# EAGLE design NE555 GEN_switchLEDv1 (EAGLE 9.0.1)
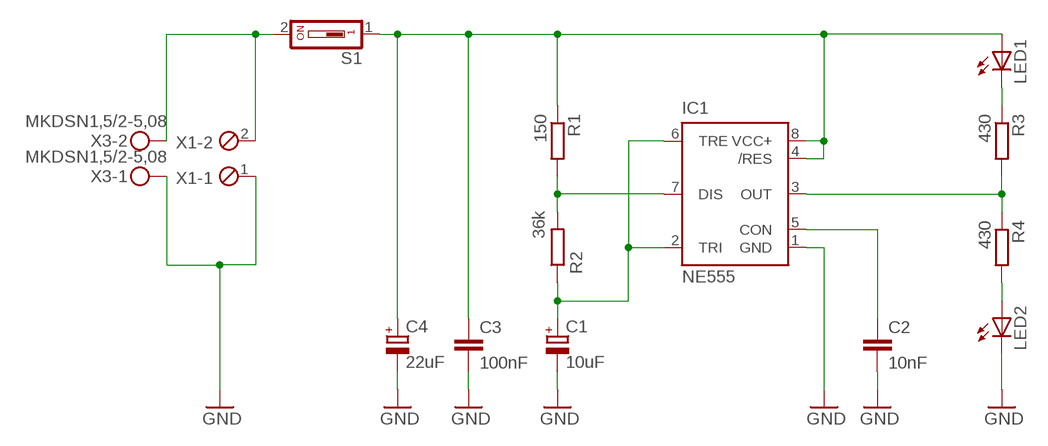
[diagram p0: schematic, sheet 1]

## Parts
C1  10uF  CPOL-EUE2.5-5  [E2,5-5]
C2  10nF  C-EU050-024X044  [C050-024X044]
C3  100nF  C-EU025-024X044  [C025-024X044]
C4  22uF  CPOL-EUE2.5-7  [E2,5-7]
IC1  NE555  [DIL-08]
LED1  LED5MM  [LED5MM]
LED2  LED5MM  [LED5MM]
R1  150  R-EU_0207/7  [0207/7]
R2  36k  R-EU_0207/7  [0207/7]
R3  430  R-EU_0207/7  [0207/7]
R4  430  R-EU_0207/7  [0207/7]
S1  DS01  [DS-01]
X1  MPT2  [2POL254]
X3  MKDSN1,5/2-5,08  [MKDSN1,5/2-5,08]

## Nets
GND: C1.- C2.2 C3.2 C4.- IC1.1(GND) LED2.K(C) X1.1 X3.1
N$1: C3.1 C4.+ IC1.4(/RES) IC1.8(VCC+) LED1.A R1.1 S1.1
N$2: C1.+ IC1.2(TRI) IC1.6(TRE) R2.1
N$3: IC1.7(DIS) R1.2 R2.2
N$4: S1.2 X1.2 X3.2
N$7: C2.1 IC1.5(CON)
N$8: LED1.K(C) R3.1
N$9: IC1.3(OUT) R3.2 R4.1
N$10: LED2.A R4.2

## Library data of the parts
C1 C4 = rcl:CPOL-EU: POLARIZED CAPACITOR, European symbol
C2 C3 = rcl:C-EU: CAPACITOR, European symbol
IC1 = st-microelectronics:NE555: General purpose bipolar Timer; MF: Arrow Electronics; MPN: NE555N; OC_FARNELL: 1467742; OC_NEWARK: 89K1486
LED1 LED2 = led:LED: LED OSRAM: - CHIPLED LG R971, LG N971, LY N971, LG Q971, LY Q971, LO R971, LY R971 LH N974, LH R974 LS Q976, LO Q976, LY Q976 LO Q996 - Hyper CHIPLED LW Q18S LB Q993, LB Q99A, LB R99A - SideLED LS A670, LO A670, LY A670, LG A670, LP A670 LB A673, LV A673, LT A673, LW A673 LH A674 LY A675 LS A676, LA A676, LO A676, LY A676, LW A676 LS A679, LY A679, LG A679 - Hyper Micro SIDELED® LS Y876, LA Y876, LO Y876, LY Y876 LT Y87S - SmartLED LW L88C, LW L88S LB L89C, LB L89S, LG L890 LS L89K, LO L89K, LY L89K LS L896, LA L896, LO L896, LY L896 - TOPLED LS T670, LO T670, LY T670, LG T670, LP T670 LSG T670, LSP T670, LSY T670, LOP T670, LYG T670 LG T671, LOG T671, LSG T671 LB T673, LV T673, LT T673, LW T673 LH T674 LS T676, LA T676, LO T676, LY T676, LB T676, LH T676, LSB T676, LW T676 LB T67C, LV T67C, LT T67C, LS T67K, LO T67K, LY T67K, LW E67C LS E67B, LA E67B, LO E67B, LY E67B, LB E67C, LV E67C, LT E67C LW T67C LS T679, LY T679, LG T679 LS T770, LO T770, LY T770, LG T770, LP T770 LB T773, LV T773, LT T773, LW T773 LH T774 LS E675, LA E675, LY E675, LS T675 LS T776, LA T776, LO T776, LY T776, LB T776 LHGB T686 LT T68C, LB T68C - Hyper Mini TOPLED® LB M676 - Mini TOPLED Santana® LG M470 LS M47K, LO M47K, LY M47K Source: http://www.osram.convergy.de LUXEON: - LUMILED® LXK2-PW12-R00, LXK2-PW12-S00, LXK2-PW14-U00, LXK2-PW14-V00 LXK2-PM12-R00, LXK2-PM12-S00, LXK2-PM14-U00 LXK2-PE12-Q00, LXK2-PE12-R00, LXK2-PE12-S00, LXK2-PE14-T00, LXK2-PE14-U00 LXK2-PB12-K00, LXK2-PB12-L00, LXK2-PB12-M00, LXK2-PB14-N00, LXK2-PB14-P00, LXK2-PB14-Q00 LXK2-PR12-L00, LXK2-PR12-M00, LXK2-PR14-Q00, LXK2-PR14-R00 LXK2-PD12-Q00, LXK2-PD12-R00, LXK2-PD12-S00 LXK2-PH12-R00, LXK2-PH12-S00 LXK2-PL12-P00, LXK2-PL12-Q00, LXK2-PL12-R00 Source: www.luxeon.com KINGBRIGHT: KA-3528ASYC Source: www.kingbright.com
R1-R4 = rcl:R-EU_: RESISTOR, European symbol
S1 = switch-dil:DS01: DIL/CODE SWITCH; OC_FARNELL: unknown; OC_NEWARK: unknown
X1 = con-phoenix-254:MPT2: PHOENIX CONNECTOR; OC_FARNELL: unknown; OC_NEWARK: unknown
X3 = con-phoenix-508:MKDSN1,5/2-5,08: MKDSN 1,5/ 2-5,08 Printklemme Nennstrom: 13,5 A Nennspannung: 250 V Rastermaß: 5,08 mm Polzahl: 2 Anschlussart: Schraubanschluss Montage: Löten Anschlussrichtung Leiter/Platine: 0 ° Artikelnummer: 1729128 Source: http://eshop.phoenixcontact.com .. 1729128.pdf

## Board
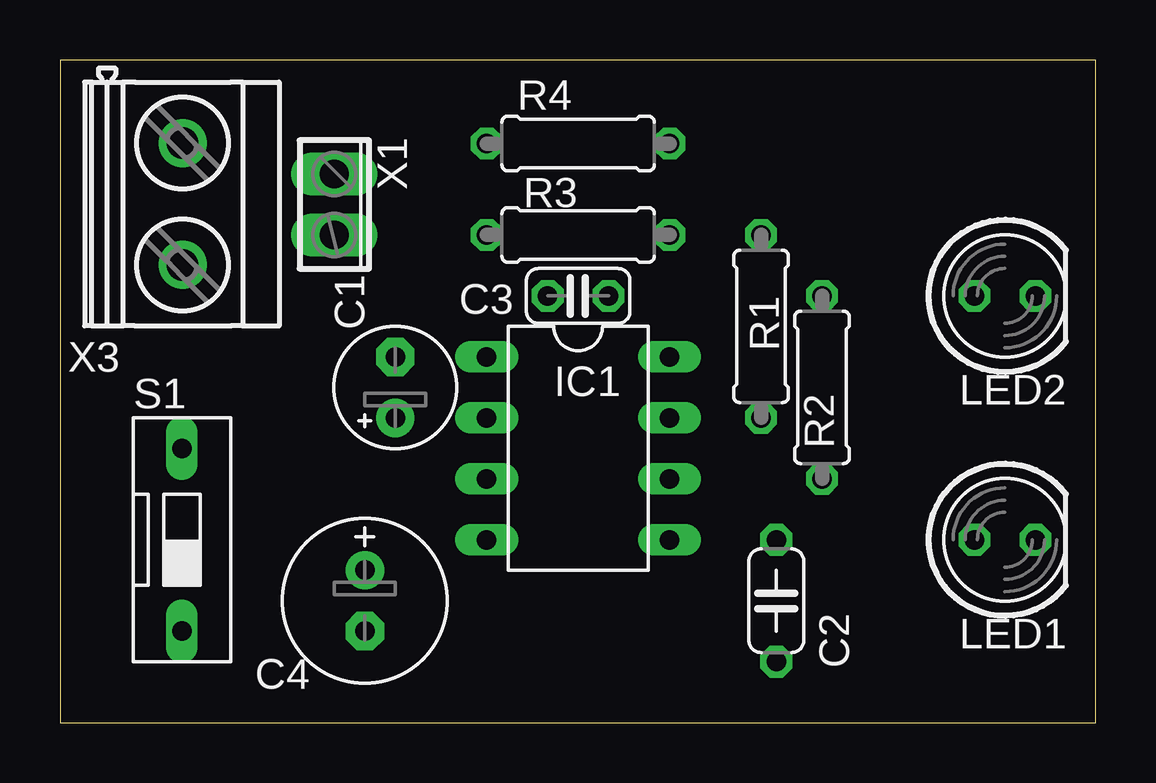
[diagram p1: board, top side]
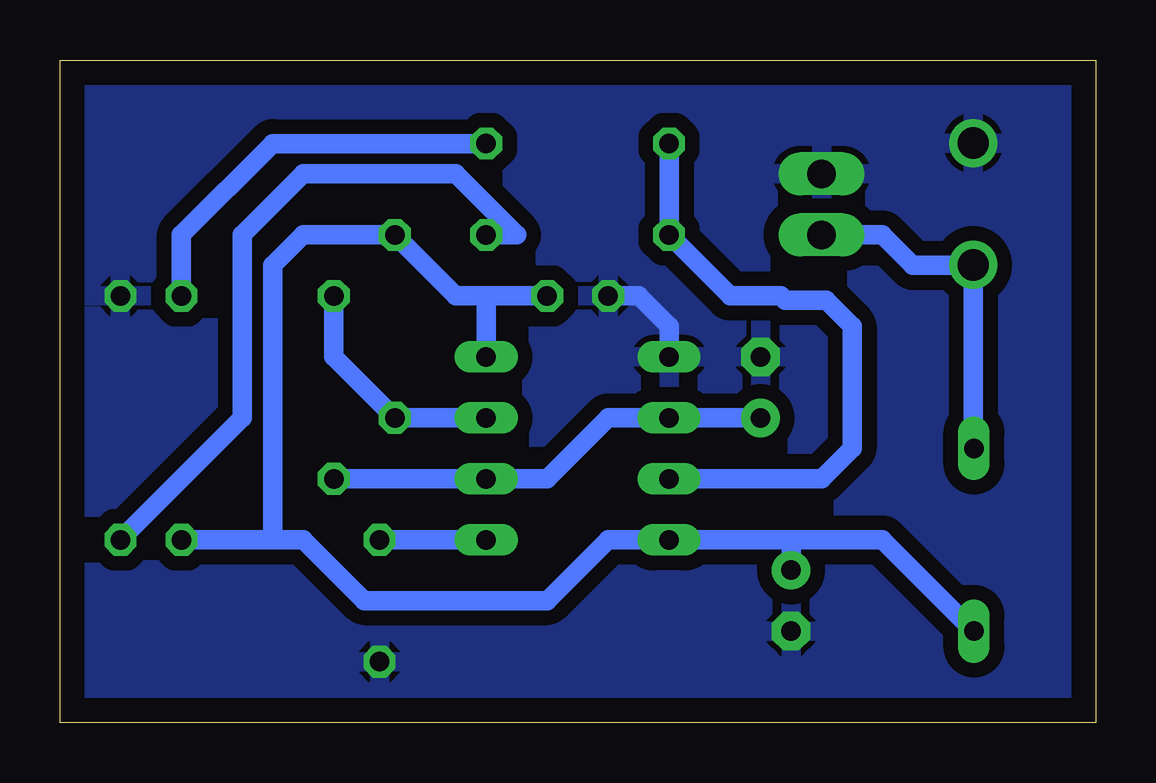
[diagram p2: board, bottom side, seen from below]

Size 43.16 x 27.61 mm. Coordinates in mm from the lower left corner, seen from the top.
Outline: 0,0 43.16,0 43.16,27.61 0,27.61 0,0
Copper layers (1*16): Top 0.035mm / dielectric 1.5mm / Bottom 0.035mm
Design rules "default": minimum track width 6mil, minimum drill 0.35mm, track to track 6mil, track to pad 6mil, pad to pad 6mil, via to via 6mil, smd to smd 6mil, copper to edge 40mil, drill to drill 6mil, minimum pad ring 10mil, minimum via ring 8mil, stop-mask expansion 4mil, vias tented up to drill 0mil, thermal gap 10mil

### Footprints (pad centres in the part's own frame; a part is rotated, then mirrored left to right if it is on the bottom)
E2,5-5 = drill 0.813 pad 1.6: + -1.27,0 | drill 0.813 pad 1.6 octagon: - 1.27,0
C050-024X044 = drill 0.813 octagon: 1 -2.54,0; 2 2.54,0
C025-024X044 = drill 0.813 octagon: 1 -1.27,0; 2 1.27,0
E2,5-7 = drill 0.813 pad 1.6: + -1.27,0 | drill 0.813 pad 1.6 octagon: - 1.27,0
DIL-08 = drill 0.813 long: 1 -3.81,-3.81; 2 -1.27,-3.81; 3 1.27,-3.81; 4 3.81,-3.81; 5 3.81,3.81; 6 1.27,3.81; 7 -1.27,3.81; 8 -3.81,3.81
LED5MM = drill 0.813 octagon: A -1.27,0; K 1.27,0
0207/7 = drill 0.813 octagon: 1 -3.81,0; 2 3.81,0
DS-01 = drill 0.813 long: 1 0,-3.81; 2 0,3.81
2POL254 = drill 1.2 long: 1 -1.27,0; 2 1.27,0
MKDSN1,5/2-5,08 = drill 1.3 pad 2: 1 -2.561,0.025; 2 2.519,0.025

### Placement (x,y rotation side)
C1  13.97,13.97 90 top
C2  29.84,5.08 270 top
C3  21.59,17.78 180 top
C4  12.7,5.08 270 top
IC1  21.59,11.43 270 top
LED1  39.37,7.62 0 top
LED2  39.37,17.78 0 top
R1  29.21,16.51 270 top
R2  31.75,13.97 90 top
R3  21.59,20.32 180 top
R4  21.59,24.13 0 top
S1  5.08,7.62 0 top
X1  11.43,21.59 270 top
X3  5.08,21.59 270 top

### Tracks (layer width: path | path; a pad name or v marks a point on that pad's centre or on a via)
GND
  Bottom 0.813: C3.2 19.05,17.78 17.78,16.51 IC1.1
  pour Bottom (isolate 0.61): 0,27.94 43.18,27.94 43.18,0 0,0
N$1
  Bottom 0.813: 34.29,7.62 34.29,19.05 33.02,20.32 R1.1 26.67,17.78 25.4,17.78 | LED1.A 34.29,7.62 | 25.4,17.78 C3.1 | 25.4,17.78 IC1.8 | 12.7,7.62 IC1.4 20.32,7.62 22.86,5.08 30.48,5.08 33.02,7.62 34.29,7.62 | 12.7,7.62 8.89,7.62 S1.1 | C4.+ 12.7,7.62
N$2
  Bottom 0.813: R2.1 IC1.6 22.86,10.16 20.32,12.7 IC1.2 C1.+
N$3
  Bottom 0.813: IC1.7 R1.2 31.75,15.24 R2.2
N$4
  Bottom 0.813: S1.2 arc90 5.11,11.46 X3.2 5.13,19.05 7.62,19.05 8.89,20.32 X1.2
N$7
  Bottom 0.813: C2.1 IC1.5
N$8
  Bottom 0.813: R3.1 24.13,20.32 26.67,22.86 33.02,22.86 35.56,20.32 35.56,12.7 LED1.K
N$9
  Bottom 0.813: R4.1 R3.2 15.24,17.78 13.12,17.78 12.93,17.59 11.24,17.59 10.16,16.51 10.16,11.43 11.43,10.16 IC1.3
N$10
  Bottom 0.813: LED2.A 38.1,20.32 34.29,24.13 R4.2